# Altium schematic sheet CircuitoControle.SchDoc: Sanhaço - Ckt Controle
size A4; DocumentNumber: CB03; Revision: 1.1; SheetNumber: 3; SheetTotal: 4
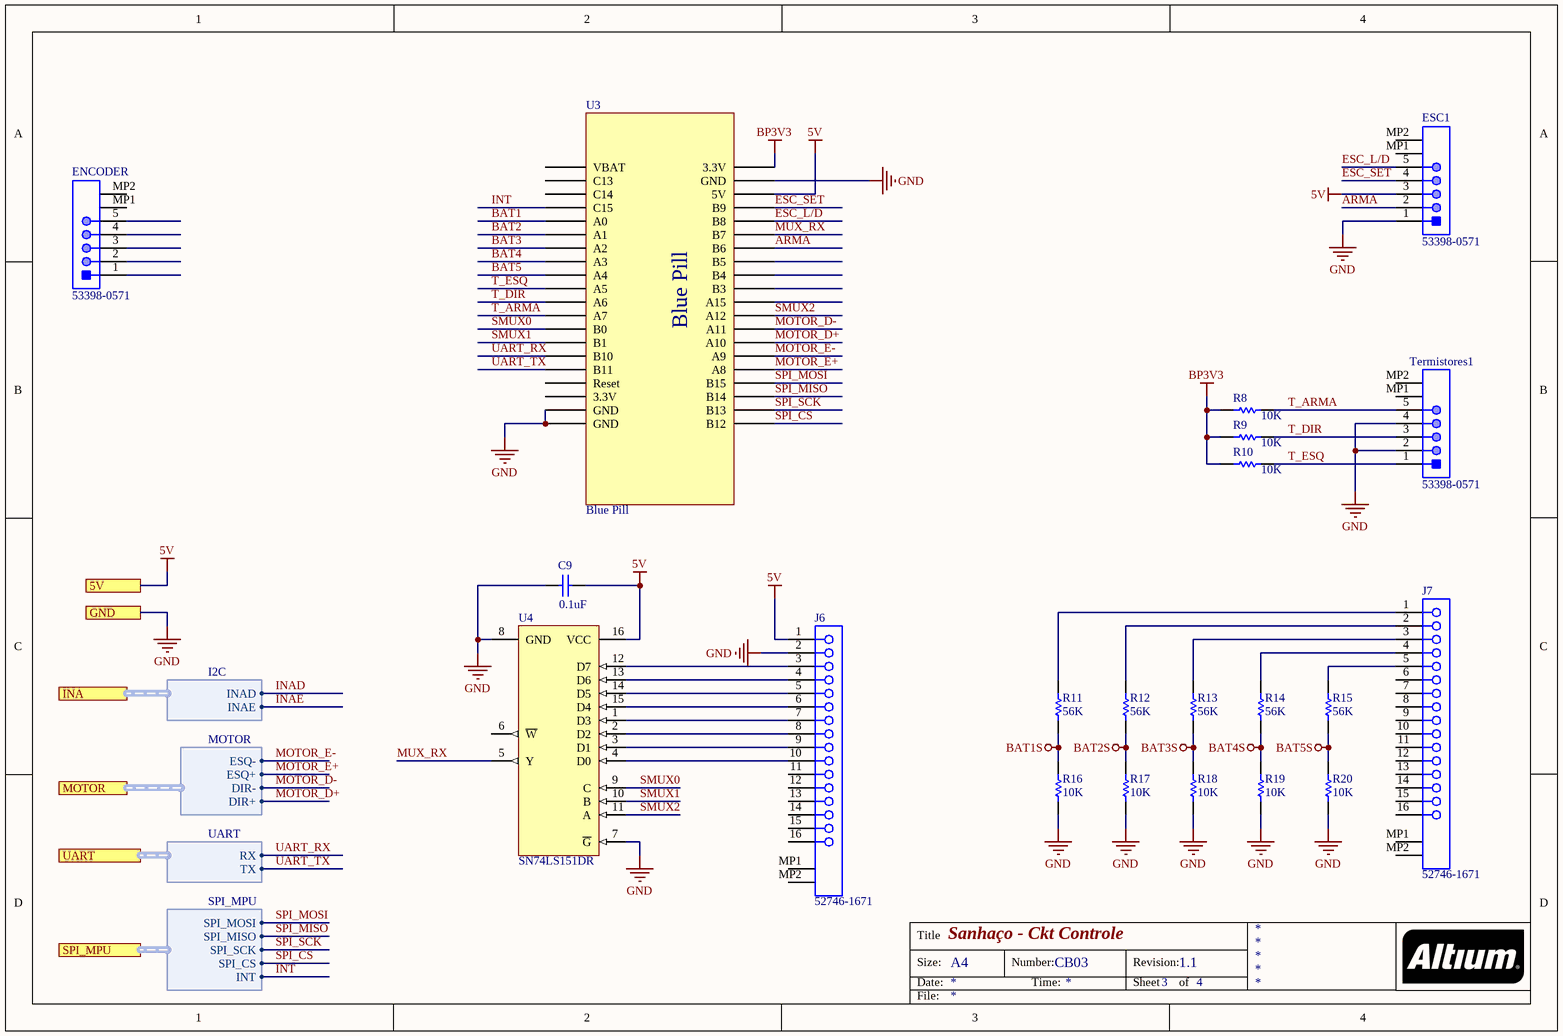
[diagram p0: CircuitoControle.SchDoc]

## Parts
C9  Capacitance Value: 0.1uF  [CAPC1608X90X30LL10T20]  (hidden comment: 710-885012206071)
ENCODER  53398-0571  [MOLX-53398-0571-5_V]
ESC1  53398-0571  [MOLX-53398-0571-5_V]
J6  52746-1671  [MOLX-52746-1671]
J7  52746-1671  [MOLX-52746-1671]
R8  10K  [RESC0402(1005)_L]
R9  10K  [RESC0402(1005)_L]
R10  10K  [RESC0402(1005)_L]
R11  56K  [RESC0402(1005)_N]
R12  56K  [RESC0402(1005)_N]
R13  56K  [RESC0402(1005)_N]
R14  56K  [RESC0402(1005)_N]
R15  56K  [RESC0402(1005)_N]
R16  10K  [RESC0402(1005)_L]
R17  10K  [RESC0402(1005)_L]
R18  10K  [RESC0402(1005)_L]
R19  10K  [RESC0402(1005)_L]
R20  10K  [RESC0402(1005)_L]
Termistores1  53398-0571  [MOLX-53398-0571-5_V]
U3  Blue Pill  [blue pill]
U4  SN74LS151DR  [D0016A_L]

## Ports
5V, GND, INA (harness I2C), MOTOR (harness MOTOR), SPI_MPU (harness SPI_MPU), UART (harness UART)

## Harnesses
UART: RX, TX
SPI_MPU: SPI_MOSI, SPI_MISO, SPI_SCK, SPI_CS, INT
I2C: INAD, INAE
MOTOR: ESQ+, DIR-, DIR+, ESQ-

## Nets
5V: C9.2 ESC1.3 J6.1 U3.?38(5V) U4.16(VCC) ; port 5V
BAT1S: R11.1 R16.2
BAT2S: R12.1 R17.2
BAT3S: R13.1 R18.2
BAT4S: R14.1 R19.2
BAT5S: R15.1 R20.2
BP3V3: R8.2 R9.2 R10.2 U3.?40(3.3V)
GND: C9.1 ESC1.1 J6.2 R16.1 R17.1 R18.1 R19.1 R20.1 Termistores1.2 Termistores1.4 U3.?19(GND) U3.?20(GND) U3.?39(GND) U4.7(~{G}) U4.8(GND) ; port GND
ARMA: ESC1.2 U3.?34(B6)
BAT1: U3.?6(A0)
BAT2: U3.?7(A1)
BAT3: U3.?8(A2)
BAT4: U3.?9(A3)
BAT5: U3.?10(A4)
ESC_L/D: ESC1.5 U3.?36(B8)
ESC_SET: ESC1.4 U3.?37(B9)
INAD: port INA.INAD
INAE: port INA.INAE
INT: U3.?5(C15) ; port SPI_MPU.INT
MOTOR_D+: U3.?27(A10) ; port MOTOR.DIR+
MOTOR_D-: U3.?28(A11) ; port MOTOR.DIR-
MOTOR_E+: U3.?25(A8) ; port MOTOR.ESQ+
MOTOR_E-: U3.?26(A9) ; port MOTOR.ESQ-
MUX_RX: U3.?35(B7) U4.5(Y)
SMUX0: U3.?14(B0) U4.9(C)
SMUX1: U3.?15(B1) U4.10(B)
SMUX2: U3.?29(A12) U4.11(A)
SPI_CS: U3.?21(B12) ; port SPI_MPU.SPI_CS
SPI_MISO: U3.?23(B14) ; port SPI_MPU.SPI_MISO
SPI_MOSI: U3.?24(B15) ; port SPI_MPU.SPI_MOSI
SPI_SCK: U3.?22(B13) ; port SPI_MPU.SPI_SCK
T_ARMA: R8.1 Termistores1.5 U3.?13(A7)
T_DIR: R9.1 Termistores1.3 U3.?12(A6)
T_ESQ: R10.1 Termistores1.1 U3.?11(A5)
UART_RX: U3.?16(B10) ; port UART.RX
UART_TX: U3.?17(B11) ; port UART.TX
NetJ6_3: J6.3 U4.12(D7)
NetJ6_4: J6.4 U4.13(D6)
NetJ6_5: J6.5 U4.14(D5)
NetJ6_6: J6.6 U4.15(D4)
NetJ6_7: J6.7 U4.1(D3)
NetJ6_8: J6.8 U4.2(D2)
NetJ6_9: J6.9 U4.3(D1)
NetJ6_10: J6.10 U4.4(D0)
NetJ7_1: J7.1 R11.2
NetJ7_2: J7.2 R12.2
NetJ7_3: J7.3 R13.2
NetJ7_4: J7.4 R14.2
NetJ7_5: J7.5 R15.2

Not connected (* = marked no-connect by the designer): ENCODER 1 2 3 4 5 MP1 MP2; ESC1 MP1 MP2; J6 11 12 13 14 15 16 MP1 MP2; J7 6 7 8 9 10 11 12 13 14 15 16 MP1 MP2; Termistores1 MP1 MP2; U3 ?1(VBAT) ?2(3.3V) ?3(C13) ?4(C14) ?18(Reset) ?30(A15) ?31(B3) ?32(B4) ?33(B5); U4 6(~{W})

## Notes on the sheet
- Title
- Size:
- Date:
- A4
- Number:
- Time:
- Revision:
- Sheet
- of
- File:

## Library data of the parts
C9 = CMP-2000-06092-1: Chip Capacitor, 100 nF, +/- 10%, 50 V, -55 to 125 degC, 0603 (1608 Metric), RoHS, Tape and Reel               710-885012206071; Manufacturer: SamsungElectro-Mechanics; Product Length: 1.6mm; Voltage: 25Vdc; Product Height: 0.8mm; Rad Hard: No; Dielectric: X7R; Packaging: Tape&Reel; Package Description: 2-Pin Surface Mount Device, Body 1.60 x 0.80 mm; Package Reference: 0603; Datasheet Version: 06/2016; Operating Temperature: -55to125°C; Category: CapacitorCeramicMultilayer; Product Depth: 0.8mm; Mounting Technology: SurfaceMount; Package/Case: 0603; Tolerance: 10%; Construction: Flat; Mounting: SurfaceMount; Datasheet URL: https://br.mouser.com/datasheet/2/445/885012206071-554587.pdf
ENCODER Termistores1 = CMP-2000-05250-1: Male Header, Pitch 1.25 mm, 1 x 5 Postion, Height 4.7 mm, -40 to 85 degC, RoHS, Tape and Reel; Brand: Molex; Number of Positions: 5Position; Mounting Angle: Vertical; Current Rating: 1A; Pitch: 1.25mm; Voltage Rating: 125V; Type: Shrouded; Tradename: PicoBlade; Datasheet Version: Rev. E, 04/2006; Housing Material: Nylon; Datasheet URL: http://www.molex.com/pdm_docs/sd/533980571_sd.pdf; Termination Style: SMD; Contact Gender: Pin(Male); Factory Pack Quantity: 1000; Number of Rows: 1Row; Product: Headers; Package Reference: MOLX-53398-0571-5; Contact Material: PhosphorBronze; RoHS: Details; Manufacturer URL: http://www.molex.com/; Product Category: Headers&WireHousings; Contact Plating: Tin; Manufacturer: Molex; Series: 53398; Packaging: Reel; Mounting Style: SMD
ESC1 = CMP-2000-05250-1: Brand: Molex; Number of Positions: 5Position; Mounting Angle: Vertical; Current Rating: 1A; Pitch: 1.25mm; Voltage Rating: 125V; Type: Shrouded; Tradename: PicoBlade; Datasheet Version: Rev. E, 04/2006; Housing Material: Nylon; Datasheet URL: http://www.molex.com/pdm_docs/sd/533980571_sd.pdf; Termination Style: SMD; Contact Gender: Pin(Male); Factory Pack Quantity: 1000; Number of Rows: 1Row; Product: Headers; Package Reference: MOLX-53398-0571-5; Contact Material: PhosphorBronze; RoHS: Details; Manufacturer URL: http://www.molex.com/; Product Category: Headers&WireHousings; Contact Plating: Tin; Manufacturer: Molex; Series: 53398; Packaging: Reel; Mounting Style: SMD
J6 J7 = CMP-1241-00378-1: 0.5 mm Pitch Easy-On(TM) Type FPC Connector, 2.0 mm Mated Height, Right Angle, ZIF, SMT, Bottom Contact, 16 Circuits, -20 to 85 degC, ELV and RoHS Compliant, Tape and Reel; Manufacturer: Molex; Voltage (Max): 50V; Durability (mating cycles max): 20; Current (Max per Contact): 0.5A; Pitch - Mating Interface: 0.50mm; PCB Retention: Yes; Stackable: No; Circuits (Loaded): 16; Material - Plating Termination: Gold; Mated Height: 2.00mm; Material - Metal: Phosphor Bronze; Entry Angle: 90degrees Angle; PackageVersion: Rev. H, 05/2009; ComponentLink1URL: http://www.molex.com/molex/index.jsp; PackageReference: 52746-1671; Contact Position: Bottom; Packing: Tape and Reel; Number of Rows: 1; ComponentLink1Description: Manufacturer URL; Mounting Technology: Surface Mount; RoHS: TRUE; Polarized to PCB: Yes; PackageDescription: 16-Lead FPC Connector, Pitch 0.5 mm; ComponentLink3Description: Package Specification; Material - Plating Mating: Gold; ComponentLink3URL: http://www.molex.com/pdm_docs/sd/527461671_sd.pdf; ComponentLink2Description: Datasheet; Orientation: Right Angle; PCB Locator: No; ComponentLink2URL: http://www.molex.com/webdocs/datasheets/pdf/en-us/0527461671_FFC_FPC_CONNECTORS.pdf; PartNumber: 52746-1671
R8-R10 = CMP-1011-00623-1: 10K 0.063W 1% 0402 (1005 Metric)  SMD                                    71-CRCW040210K0FKEDC; Case-Metric: 1005; Value: 10000.00 Ohm; Case-EIA: 0402; Tolerance: 1 %; Technology: SMT; Power: 0.063 W
R11-R15 = CMP-1011-00708-1: 56K 0.063W 1% 0402 (1005 Metric)  SMD; Value: 56000.00 Ohm; Case-EIA: 0402; Case-Metric: 1005; Tolerance: 1 %; Power: 0.063 W; Technology: SMT
R16-R20 = CMP-1011-00623-1: 10K 0.063W 1% 0402 (1005 Metric)  SMD                                         71-CRCW040210K0FKEDC; Case-Metric: 1005; Value: 10000.00 Ohm; Case-EIA: 0402; Tolerance: 1 %; Technology: SMT; Power: 0.063 W
U4 = CMP-1633-00148-1: 8-Line To 1-Line Data Selectors/Multiplexers, D0016A, LARGE T&R; Manufacturer: Texas Instruments; VCC(Max)(V): 5.25; Configuration: "16","1"; Channels(#): 1; F @ Nom Voltage(Max)(Mhz): 35; Input Type: TTL; Output Drive (IOL/IOH)(Max)(mA): 8/-0.4; Voltage(Nom)(V): 5; Bits(#): 16; VCC(Min)(V): 4.75; Technology Family: LS; tpd @ Nom Voltage(Max)(ns): 38; Function: Encoder/Multiplexer; Schmitt Trigger: No; Rating: Catalog; ICC @ Nom Voltage(Max)(mA): 10; PartNumber: SN74LS151DR; Operating Temperature Range(C): 0 to 70; Type: Standard; ComponentLink3URL: http://www.ti.com/lit/ml/mpds178g/mpds178g.pdf; ComponentLink1Description: Manufacturer URL; ComponentLink2Description: Datasheet; DatasheetVersion: SDLS054; Output Type: TTL; PackageReference: D0016A; ComponentLink1URL: http://www.ti.com/; Code_JEDEC: MS-012 variation AC; ComponentLink2URL: http://www.ti.com/lit/ds/symlink/sn74ls151.pdf; ComponentLink3Description: Package Specification; Generic Part Number: SN74LS151